# Altium schematic sheet 10_FPGA_PWR.SchDoc
size A3; DocumentNumber: 10; SheetNumber: 10; SheetTotal: 21
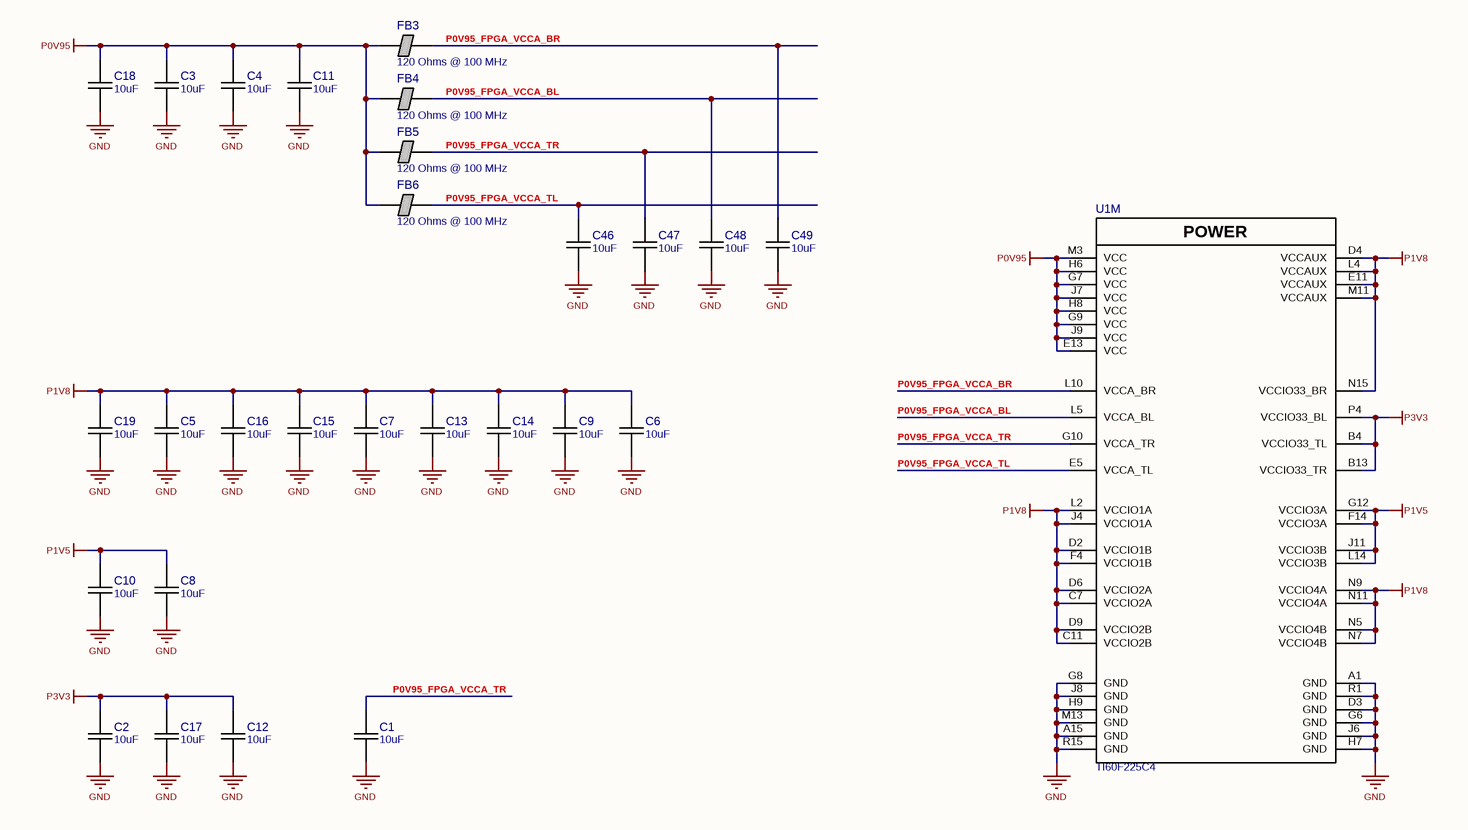
[diagram p0: 10_FPGA_PWR.SchDoc]

## Parts
C1  10uF  [CAPC1005X06N]
C2  10uF  [CAPC1005X06N]
C3  10uF  [CAPC1005X06N]
C4  10uF  [CAPC1005X06N]
C5  10uF  [CAPC1005X06N]
C6  10uF  [CAPC1005X06N]
C7  10uF  [CAPC1005X06N]
C8  10uF  [CAPC1005X06N]
C9  10uF  [CAPC1005X06N]
C10  10uF  [CAPC1005X06N]
C11  10uF  [CAPC1005X06N]
C12  10uF  [CAPC1005X06N]
C13  10uF  [CAPC1005X06N]
C14  10uF  [CAPC1005X06N]
C15  10uF  [CAPC1005X06N]
C16  10uF  [CAPC1005X06N]
C17  10uF  [CAPC1005X06N]
C18  10uF  [CAPC1005X06N]
C19  10uF  [CAPC1005X06N]
C46  10uF  [CAPC1005X06N]
C47  10uF  [CAPC1005X06N]
C48  10uF  [CAPC1005X06N]
C49  10uF  [CAPC1005X06N]
FB3  120 Ohms @ 100 MHz  [INDC1005X05N]
FB4  120 Ohms @ 100 MHz  [INDC1005X05N]
FB5  120 Ohms @ 100 MHz  [INDC1005X05N]
FB6  120 Ohms @ 100 MHz  [INDC1005X05N]
U1  TI60F225C4  [BGA225C65P15X15_1000X1000X100]  (part M of 13)

## Nets
GND: C1.1 C2.1 C3.1 C4.1 C5.1 C6.1 C7.1 C8.1 C9.1 C10.1 C11.1 C12.1 C13.1 C14.1 C15.1 C16.1 C17.1 C18.1 C19.1 C46.1 C47.1 C48.1 C49.1 U1.A1(GND) U1.A15(GND) U1.D3(GND) U1.G6(GND) U1.G8(GND) U1.H7(GND) U1.H9(GND) U1.J6(GND) U1.J8(GND) U1.M13(GND) U1.R1(GND) U1.R15(GND)
P0V95: C3.2 C4.2 C11.2 C18.2 FB3.1 FB4.1 FB5.1 FB6.1 U1.E13(VCC) U1.G7(VCC) U1.G9(VCC) U1.H6(VCC) U1.H8(VCC) U1.J7(VCC) U1.J9(VCC) U1.M3(VCC)
P1V5: C8.2 C10.2 U1.F14(VCCIO3A) U1.G12(VCCIO3A) U1.J11(VCCIO3B) U1.L14(VCCIO3B)
P1V8: C5.2 C6.2 C7.2 C9.2 C13.2 C14.2 C15.2 C16.2 C19.2 U1.C7(VCCIO2A) U1.C11(VCCIO2B) U1.D2(VCCIO1B) U1.D4(VCCAUX) U1.D6(VCCIO2A) U1.D9(VCCIO2B) U1.E11(VCCAUX) U1.F4(VCCIO1B) U1.J4(VCCIO1A) U1.L2(VCCIO1A) U1.L4(VCCAUX) U1.M11(VCCAUX) U1.N5(VCCIO4B) U1.N7(VCCIO4B) U1.N9(VCCIO4A) U1.N11(VCCIO4A) U1.N15(VCCIO33_BR)
P3V3: C2.2 C12.2 C17.2 U1.B4(VCCIO33_TL) U1.B13(VCCIO33_TR) U1.P4(VCCIO33_BL)
P0V95_FPGA_VCCA_BL: C48.2 FB4.2 U1.L5(VCCA_BL)
P0V95_FPGA_VCCA_BR: C49.2 FB3.2 U1.L10(VCCA_BR)
P0V95_FPGA_VCCA_TL: C46.2 FB6.2 U1.E5(VCCA_TL)
P0V95_FPGA_VCCA_TR: C1.2 C47.2 FB5.2 U1.G10(VCCA_TR)

## Notes on the sheet
- (in symbol TI60F225C4, part M) POWER

## Library data of the parts
C1-C19 C46-C49 = GRM155R60J106ME47D: CAP CER 10UF 6.3V X5R 0402; Manufacturer 1: Murata Electronics; Tol: 20%; Part Number: GRM155R60J106ME47D; Value: 10uF; Voltage: 6.3V; TempC: X5R; Manufacturer Part Number 1: GRM155R60J106ME47D; Supplier 1: Digi-Key; Supplier Part Number 1: 490-13239-1-ND
FB3-FB6 = BLM15PD121SN1D: FERRITE BEAD 120 OHM 0402 1LN; Manufacturer 1: Murata Electronics; DCR: 90mOhm; Ir: 1.3A; Part Number: BLM15PD121SN1D; Value: 120 Ohms @ 100 MHz; Manufacturer Part Number 1: BLM15PD121SN1D; Supplier 1: Digi-Key; Supplier Part Number 1: 490-5203-1-ND
U1 = TI60F225C4: FPGA TITAN 140HSIO 4PLL 225BGA; Manufacturer 1: Efinix, Inc.; Part Number: TI60F225C4; Manufacturer Part Number 1: TI60F225C4; Supplier 1: Digi-Key; Supplier Part Number 1: 2134-TI60F225C4-ND